# EAGLE design ProgrammersKeyboard_Keyboard_Schematic (EAGLE 6.0)
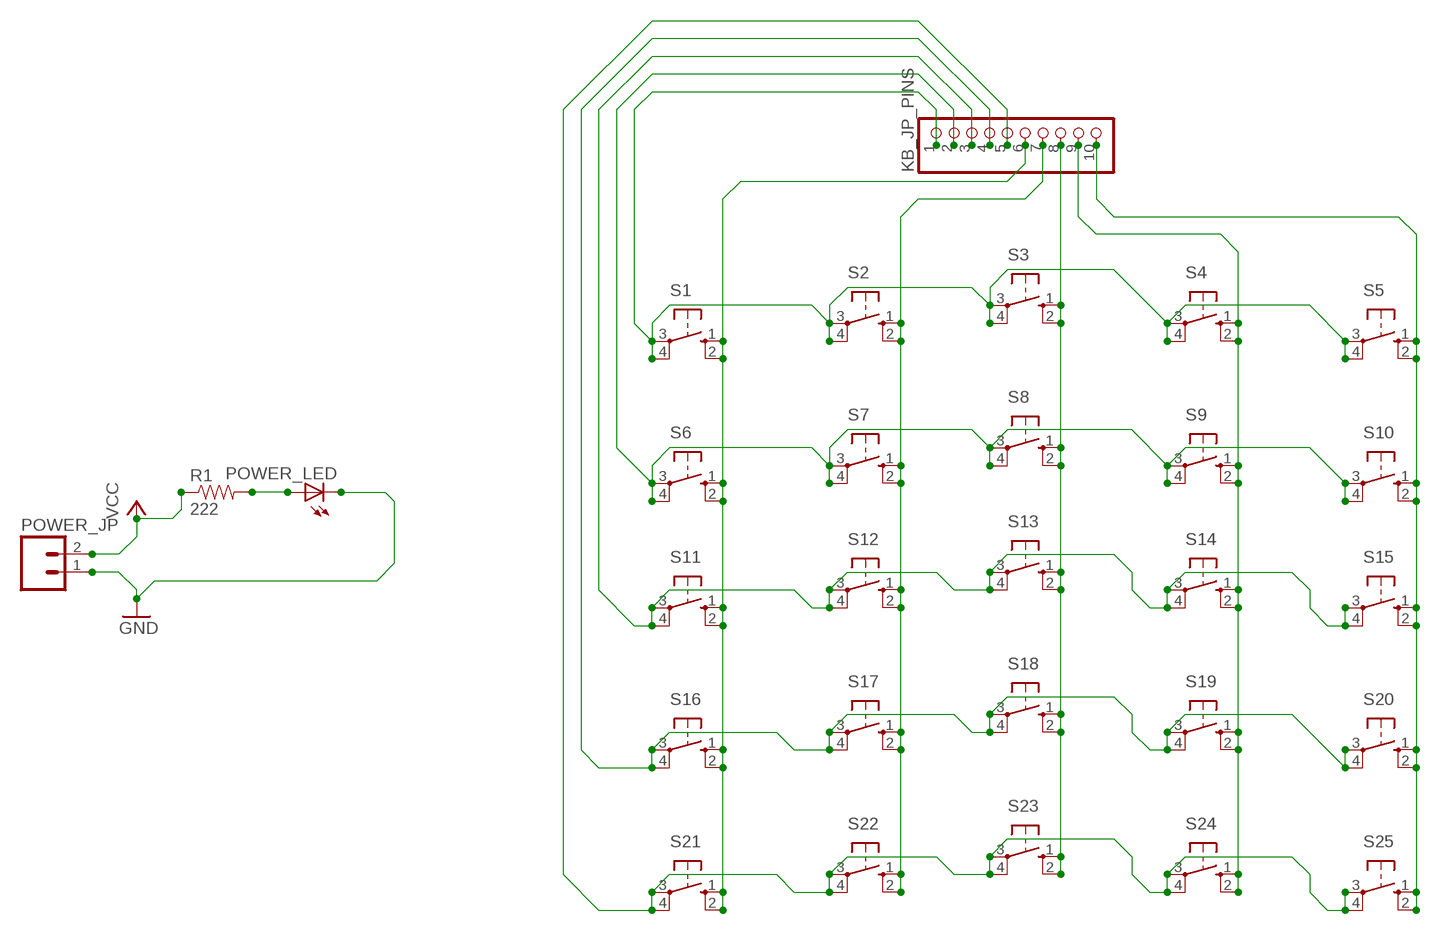
[diagram p0: schematic, sheet 1]

## Parts
KB_JP_PINS  PINHD-1X10/90  [1X10/90]
POWER_JP  M02PTH3  [1X02_LONGPADS]
POWER_LED  LEDSMT1206  [1206]
R1  222  RESISTOR1206  [1206]
S1  10-XX  [B3F-10XX]
S2  10-XX  [B3F-10XX]
S3  10-XX  [B3F-10XX]
S4  10-XX  [B3F-10XX]
S5  10-XX  [B3F-10XX]
S6  10-XX  [B3F-10XX]
S7  10-XX  [B3F-10XX]
S8  10-XX  [B3F-10XX]
S9  10-XX  [B3F-10XX]
S10  10-XX  [B3F-10XX]
S11  10-XX  [B3F-10XX]
S12  10-XX  [B3F-10XX]
S13  10-XX  [B3F-10XX]
S14  10-XX  [B3F-10XX]
S15  10-XX  [B3F-10XX]
S16  10-XX  [B3F-10XX]
S17  10-XX  [B3F-10XX]
S18  10-XX  [B3F-10XX]
S19  10-XX  [B3F-10XX]
S20  10-XX  [B3F-10XX]
S21  10-XX  [B3F-10XX]
S22  10-XX  [B3F-10XX]
S23  10-XX  [B3F-10XX]
S24  10-XX  [B3F-10XX]
S25  10-XX  [B3F-10XX]

## Nets
GND: POWER_JP.1 POWER_LED.C
N$3: KB_JP_PINS.3 S11.3(P) S11.4(P1) S12.3(P) S12.4(P1) S13.3(P) S13.4(P1) S14.3(P) S14.4(P1) S15.3(P) S15.4(P1)
N$4: KB_JP_PINS.4 S16.3(P) S16.4(P1) S17.3(P) S17.4(P1) S18.3(P) S18.4(P1) S19.3(P) S19.4(P1) S20.3(P) S20.4(P1)
N$5: KB_JP_PINS.5 S21.3(P) S21.4(P1) S22.3(P) S22.4(P1) S23.3(P) S23.4(P1) S24.3(P) S24.4(P1) S25.3(P) S25.4(P1)
N$8: POWER_LED.A R1.2
N$10: KB_JP_PINS.10 S5.1(S) S5.2(S1) S10.1(S) S10.2(S1) S15.1(S) S15.2(S1) S20.1(S) S20.2(S1) S25.1(S) S25.2(S1)
N$30: KB_JP_PINS.6 S1.1(S) S1.2(S1) S6.1(S) S6.2(S1) S11.1(S) S11.2(S1) S16.1(S) S16.2(S1) S21.1(S) S21.2(S1)
N$44: KB_JP_PINS.1 S1.3(P) S1.4(P1) S2.3(P) S2.4(P1) S3.3(P) S3.4(P1) S4.3(P) S4.4(P1) S5.3(P) S5.4(P1)
N$62: KB_JP_PINS.7 S2.1(S) S2.2(S1) S7.1(S) S7.2(S1) S12.1(S) S12.2(S1) S17.1(S) S17.2(S1) S22.1(S) S22.2(S1)
N$66: KB_JP_PINS.8 S3.1(S) S3.2(S1) S8.1(S) S8.2(S1) S13.1(S) S13.2(S1) S18.1(S) S18.2(S1) S23.1(S) S23.2(S1)
N$94: KB_JP_PINS.9 S4.1(S) S4.2(S1) S9.1(S) S9.2(S1) S14.1(S) S14.2(S1) S19.1(S) S19.2(S1) S24.1(S) S24.2(S1)
N$110: KB_JP_PINS.2 S6.3(P) S6.4(P1) S7.3(P) S7.4(P1) S8.3(P) S8.4(P1) S9.3(P) S9.4(P1) S10.3(P) S10.4(P1)
VCC: POWER_JP.2 R1.1

## Library data of the parts
KB_JP_PINS = pinhead:PINHD-1X10: PIN HEADER
POWER_JP = SparkFun-Connectors:M02: Header 2 Standard 2-pin 0.1" header. Use with straight break away headers (SKU : PRT-00116), right angle break away headers (PRT-00553), swiss pins (PRT-00743), machine pins (PRT-00117), and female headers (PRT-00115). Molex polarized connector foot print use with SKU : PRT-08233 with associated crimp pins and housings.
POWER_LED = led:LED: LED OSRAM: - CHIPLED LG R971, LG N971, LY N971, LG Q971, LY Q971, LO R971, LY R971 LH N974, LH R974 LS Q976, LO Q976, LY Q976 LO Q996 - Hyper CHIPLED LW Q18S LB Q993, LB Q99A, LB R99A - SideLED LS A670, LO A670, LY A670, LG A670, LP A670 LB A673, LV A673, LT A673, LW A673 LH A674 LY A675 LS A676, LA A676, LO A676, LY A676, LW A676 LS A679, LY A679, LG A679 - Hyper Micro SIDELED® LS Y876, LA Y876, LO Y876, LY Y876 LT Y87S - SmartLED LW L88C, LW L88S LB L89C, LB L89S, LG L890 LS L89K, LO L89K, LY L89K LS L896, LA L896, LO L896, LY L896 - TOPLED LS T670, LO T670, LY T670, LG T670, LP T670 LSG T670, LSP T670, LSY T670, LOP T670, LYG T670 LG T671, LOG T671, LSG T671 LB T673, LV T673, LT T673, LW T673 LH T674 LS T676, LA T676, LO T676, LY T676, LB T676, LH T676, LSB T676, LW T676 LB T67C, LV T67C, LT T67C, LS T67K, LO T67K, LY T67K, LW E67C LS E67B, LA E67B, LO E67B, LY E67B, LB E67C, LV E67C, LT E67C LW T67C LS T679, LY T679, LG T679 LS T770, LO T770, LY T770, LG T770, LP T770 LB T773, LV T773, LT T773, LW T773 LH T774 LS E675, LA E675, LY E675, LS T675 LS T776, LA T776, LO T776, LY T776, LB T776 LHGB T686 LT T68C, LB T68C - Hyper Mini TOPLED® LB M676 - Mini TOPLED Santana® LG M470 LS M47K, LO M47K, LY M47K Source: http://www.osram.convergy.de LUXEON: - LUMILED® LXK2-PW12-R00, LXK2-PW12-S00, LXK2-PW14-U00, LXK2-PW14-V00 LXK2-PM12-R00, LXK2-PM12-S00, LXK2-PM14-U00 LXK2-PE12-Q00, LXK2-PE12-R00, LXK2-PE12-S00, LXK2-PE14-T00, LXK2-PE14-U00 LXK2-PB12-K00, LXK2-PB12-L00, LXK2-PB12-M00, LXK2-PB14-N00, LXK2-PB14-P00, LXK2-PB14-Q00 LXK2-PR12-L00, LXK2-PR12-M00, LXK2-PR14-Q00, LXK2-PR14-R00 LXK2-PD12-Q00, LXK2-PD12-R00, LXK2-PD12-S00 LXK2-PH12-R00, LXK2-PH12-S00 LXK2-PL12-P00, LXK2-PL12-Q00, LXK2-PL12-R00 Source: www.luxeon.com KINGBRIGHT: KA-3528ASYC Source: www.kingbright.com
R1 = SparkFun-Resistors:RESISTOR: Resistor Basic schematic elements and footprints for 0603, 1206, and PTH resistors.
S1-S25 = switch-omron:10-XX: OMRON SWITCH; MPN: B3F-1000; OC_FARNELL: 176432; OC_NEWARK: 36M3542

## Board
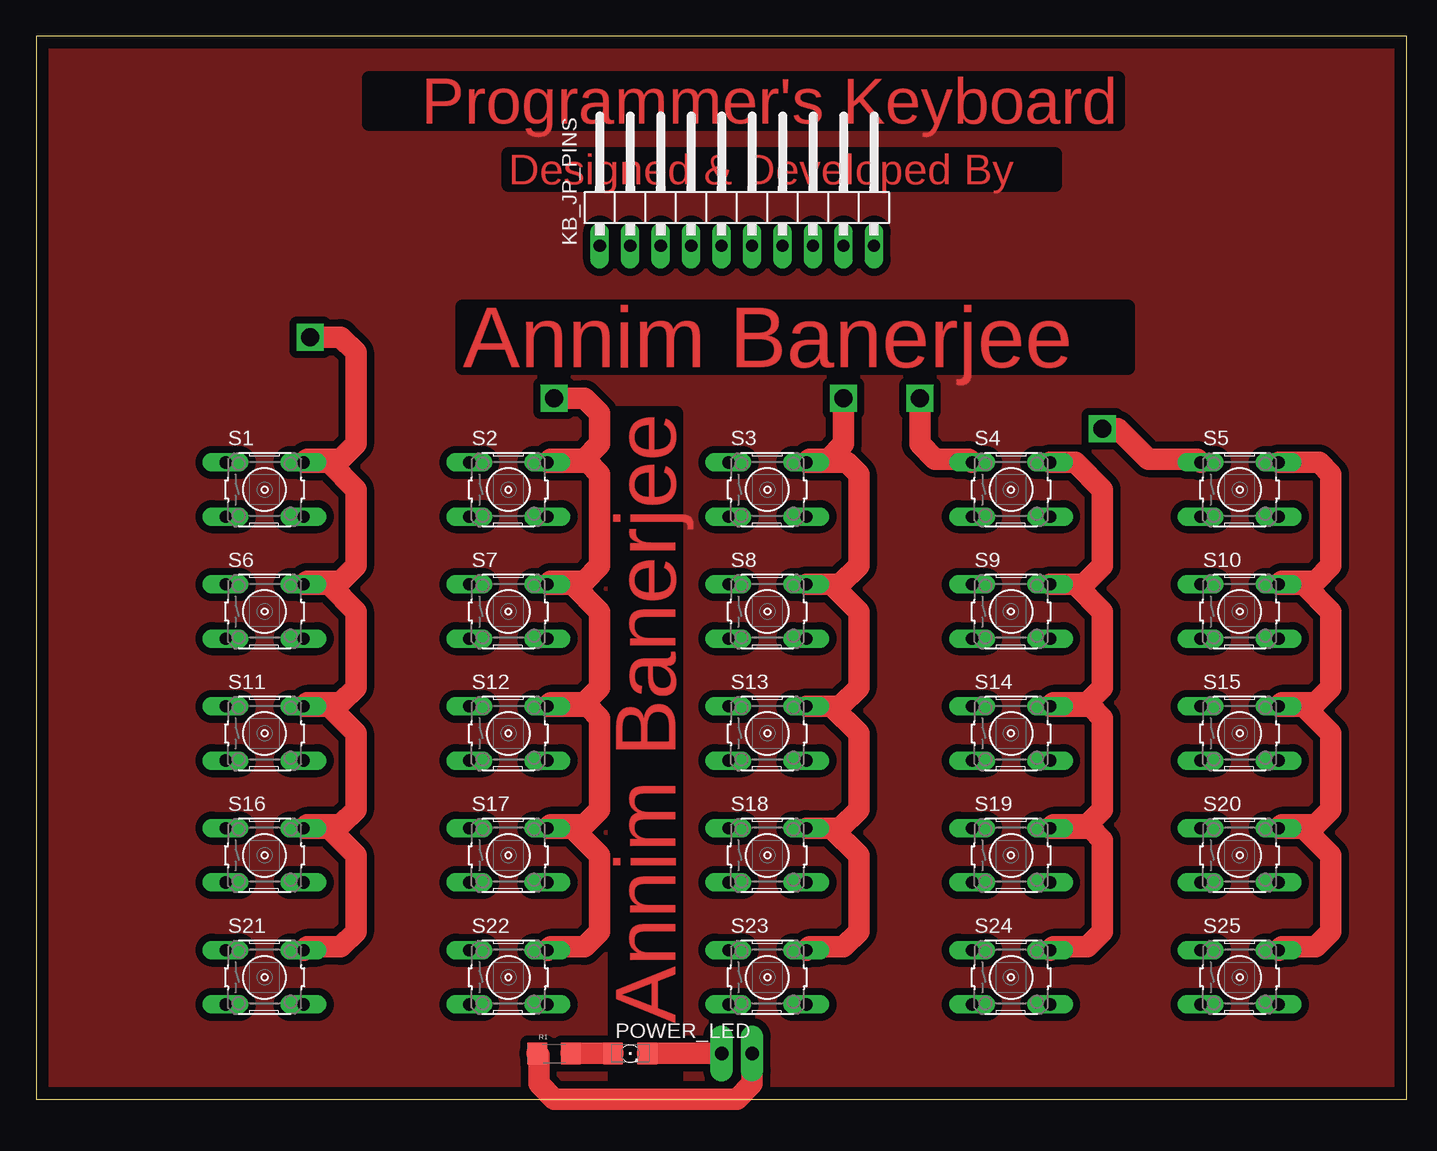
[diagram p1: board, top side]
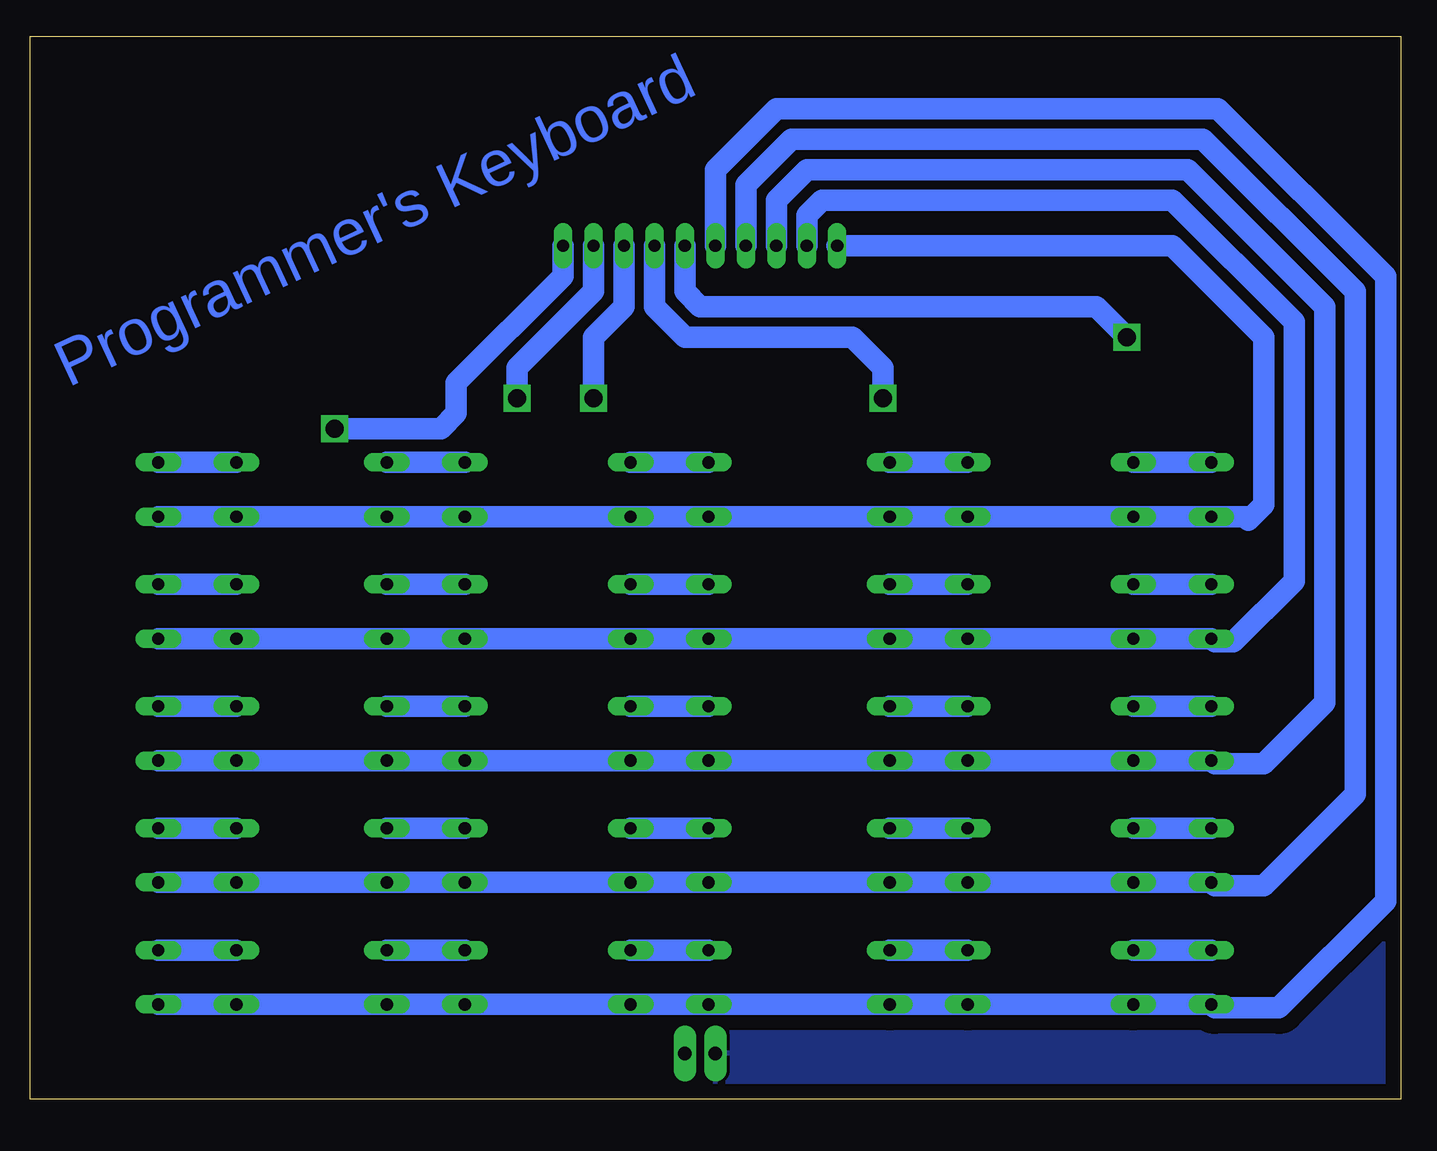
[diagram p2: board, bottom side, seen from below]

Size 114.28 x 88.57 mm. Coordinates in mm from the lower left corner, seen from the top.
Outline: 0,0 114.28,0 114.28,88.57 0,88.57 0,0
Copper layers (1*16): Top 0.035mm / dielectric 1.5mm / Bottom 0.035mm
Design rules: minimum track width 10mil, minimum drill 24mil, track to track 8mil, track to pad 8mil, pad to pad 8mil, via to via 8mil, smd to smd 8mil, copper to edge 40mil, drill to drill 8mil, minimum pad ring 10mil, minimum via ring 8mil, stop-mask expansion 4mil, vias tented up to drill 0mil, thermal gap 10mil

### Footprints (pad centres in the part's own frame; a part is rotated, then mirrored left to right if it is on the bottom)
1X10/90 = drill 1.016 long: 1 -11.43,-3.81; 2 -8.89,-3.81; 3 -6.35,-3.81; 4 -3.81,-3.81; 5 -1.27,-3.81; 6 1.27,-3.81; 7 3.81,-3.81; 8 6.35,-3.81; 9 8.89,-3.81; 10 11.43,-3.81
1X02_LONGPADS = drill 1.118 pad 1.88 long: 1 0,0; 2 2.54,0
1206 = smd 1.6 x 1.803: A -1.422,0; C 1.422,0
1206' = smd 1.6 x 1.8: 1 -1.4,0; 2 1.4,0
B3F-10XX = drill 1.016 long: 1 -3.251,2.261; 2 3.251,2.261; 3 -3.251,-2.261; 4 3.251,-2.261

### Placement (x,y rotation side)
KB_JP_PINS  58.42,74.93 0 top
POWER_JP  57.15,3.81 0 top
POWER_LED  49.53,3.81 0 top
R1  222  [1206']  43.18,3.81 0 top
S1  19.05,50.8 0 top
S2  39.37,50.8 0 top
S3  60.96,50.8 0 top
S4  81.28,50.8 0 top
S5  100.33,50.8 0 top
S6  19.05,40.64 0 top
S7  39.37,40.64 0 top
S8  60.96,40.64 0 top
S9  81.28,40.64 0 top
S10  100.33,40.64 0 top
S11  19.05,30.48 0 top
S12  39.37,30.48 0 top
S13  60.96,30.48 0 top
S14  81.28,30.48 0 top
S15  100.33,30.48 0 top
S16  19.05,20.32 0 top
S17  39.37,20.32 0 top
S18  60.96,20.32 0 top
S19  81.28,20.32 0 top
S20  100.33,20.32 0 top
S21  19.05,10.16 0 top
S22  39.37,10.16 0 top
S23  60.96,10.16 0 top
S24  81.28,10.16 0 top
S25  100.33,10.16 0 top

### Tracks (layer width: path | path; a pad name or v marks a point on that pad's centre or on a via)
GND
  Top 1.778: POWER_LED.C POWER_JP.1
  pour Bottom (isolate 1.27): 0,88.9 114.3,88.9 114.3,0 0,0
N$1
  pour Top (isolate 0.61): 0,88.9 114.3,88.9 114.3,0 0,0
N$3
  Bottom 1.778: KB_JP_PINS.3 52.07,74.93 49.53,77.47 17.78,77.47 6.35,66.04 6.35,33.02 11.43,27.94 15.52,27.94 S11.3 S11.4 S12.3 S12.4 S13.3 S13.4 S14.3 S14.4 S15.3 S15.4
N$4
  Bottom 1.778: KB_JP_PINS.4 54.61,76.2 50.8,80.01 16.51,80.01 3.81,67.31 3.81,25.4 11.43,17.78 15.52,17.78 S16.3 S16.4 S17.3 S17.4 S18.3 S18.4 S19.3 S19.4 S20.3 S20.4
N$5
  Bottom 1.778: KB_JP_PINS.5 57.15,77.47 52.07,82.55 15.24,82.55 1.27,68.58 1.27,16.51 10.16,7.62 15.52,7.62 S21.3 S21.4 S22.3 S22.4 S23.3 S23.4 S24.3 S24.4 S25.3 S25.4
N$8
  Top 1.778: R1.2 POWER_LED.A
N$10  (via drill 1.5)
  Top 1.778: v88.9,55.88 90.17,55.88 92.71,53.34 96.8,53.34 S5.1 | S5.2 106.96,53.06 107.95,52.07 107.95,44.45 106.68,43.18 103.86,43.18 S10.2 105.69,42.9 107.95,40.64 107.95,34.29 106.68,33.02 103.86,33.02 S15.2 105.69,32.74 107.95,30.48 107.95,24.13 106.68,22.86 103.86,22.86 S20.2 105.69,22.58 107.95,20.32 107.95,13.97 106.68,12.7 103.86,12.7 S25.2
  Bottom 1.778: S5.2 S5.1 | S25.1 S25.2 | S20.1 S20.2 | S10.1 S10.2 | S15.1 S15.2 | KB_JP_PINS.10 69.85,68.58 78.74,59.69 78.74,57.15 80.01,55.88 v88.9,55.88
N$30  (via drill 1.5)
  Top 1.778: v22.86,63.5 25.4,63.5 26.67,62.23 26.67,54.61 25.4,53.34 22.58,53.34 S1.2 24.41,53.06 26.67,50.8 26.67,44.45 25.4,43.18 22.58,43.18 S6.2 24.41,42.9 26.67,40.64 26.67,34.29 25.4,33.02 22.58,33.02 S11.2 24.41,32.74 26.67,30.48 26.67,24.13 25.4,22.86 22.58,22.86 S16.2 24.41,22.58 26.67,20.32 26.67,13.97 25.4,12.7 22.58,12.7 S21.2
  Bottom 1.778: S1.2 S1.1 | S6.1 S6.2 | S21.1 S21.2 | S16.1 S16.2 | S11.1 S11.2 | KB_JP_PINS.6 59.69,67.31 58.42,66.04 25.4,66.04 v22.86,63.5
N$44
  Bottom 1.778: KB_JP_PINS.1 19.05,71.12 11.43,63.5 11.43,49.53 12.7,48.26 12.98,48.54 S1.3 S1.4 S2.3 S2.4 S3.3 S3.4 S4.3 S4.4 S5.3 S5.4
N$62  (via drill 1.5)
  Top 1.778: v43.18,58.42 45.72,58.42 46.99,57.15 46.99,54.61 45.72,53.34 42.9,53.34 S2.2 46,53.06 46.99,52.07 46.99,44.45 45.72,43.18 42.9,43.18 S7.2 44.73,42.9 46.99,40.64 46.99,34.29 45.72,33.02 42.9,33.02 S12.2 46,32.74 46.99,31.75 46.99,24.13 45.72,22.86 42.9,22.86 S17.2 44.73,22.58 46.99,20.32 46.99,13.97 45.72,12.7 42.9,12.7 S22.2
  Bottom 1.778: S2.1 S2.2 | S7.1 S7.2 | S22.1 S22.2 | S17.1 S17.2 | S12.1 S12.2 | KB_JP_PINS.7 62.23,66.04 59.69,63.5 45.72,63.5 43.18,60.96 v43.18,58.42
N$66  (via drill 1.5)
  Top 1.778: v67.31,58.42 67.31,54.61 66.04,53.34 64.49,53.34 S3.2 67.59,53.06 68.58,52.07 68.58,44.45 67.03,42.9 S8.2 66.32,42.9 68.58,40.64 68.58,34.29 67.03,32.74 S13.2 66.32,32.74 68.58,30.48 68.58,24.13 67.03,22.58 S18.2 66.32,22.58 68.58,20.32 68.58,13.97 67.31,12.7 64.49,12.7 S23.2
  Bottom 1.778: S3.1 S3.2 | S23.1 S23.2 | S18.1 S18.2 | S8.1 S8.2 | S13.1 S13.2 | KB_JP_PINS.8 64.77,66.04 67.31,63.5 v67.31,58.42
N$94  (via drill 1.5)
  Top 1.778: v73.66,58.42 73.66,54.61 74.93,53.34 77.75,53.34 S4.1 | S4.2 86.64,53.06 88.9,50.8 88.9,44.45 87.35,42.9 S9.2 86.64,42.9 88.9,40.64 88.9,34.29 87.63,33.02 84.81,33.02 S14.2 87.91,32.74 88.9,31.75 88.9,24.13 87.63,22.86 84.81,22.86 S19.2 87.91,22.58 88.9,21.59 88.9,13.97 87.63,12.7 84.81,12.7 S24.2
  Bottom 1.778: S4.1 S4.2 | S24.1 S24.2 | S19.1 S19.2 | S9.1 S9.2 | S14.1 S14.2 | KB_JP_PINS.9 67.31,67.31 73.66,60.96 v73.66,58.42
N$110
  Bottom 1.778: KB_JP_PINS.2 49.53,73.66 48.26,74.93 19.05,74.93 8.89,64.77 8.89,43.18 13.97,38.1 15.52,38.1 S6.3 S6.4 S7.3 S7.4 S8.3 S8.4 S9.3 S9.4 S10.3 S10.4
VCC
  Top 1.778: POWER_JP.2 59.69,1.27 58.42,0 43.18,0 41.91,1.27 41.91,3.68 R1.1
(copper drawn outside any net)
  shapes: Bottom circle x4, Top circle x4

### Text on the board
Top: Programmer's Keyboard | Designed & Developed By | Annim Banerjee | Annim Banerjee
Bottom: Programmer's Keyboard